# EAGLE design CarPC-CC-Var2 (EAGLE 9.5.2)
Car-PC Command & Control sowie Power Distribution Board für PC, Access-Point

## Sheet 1 of 2
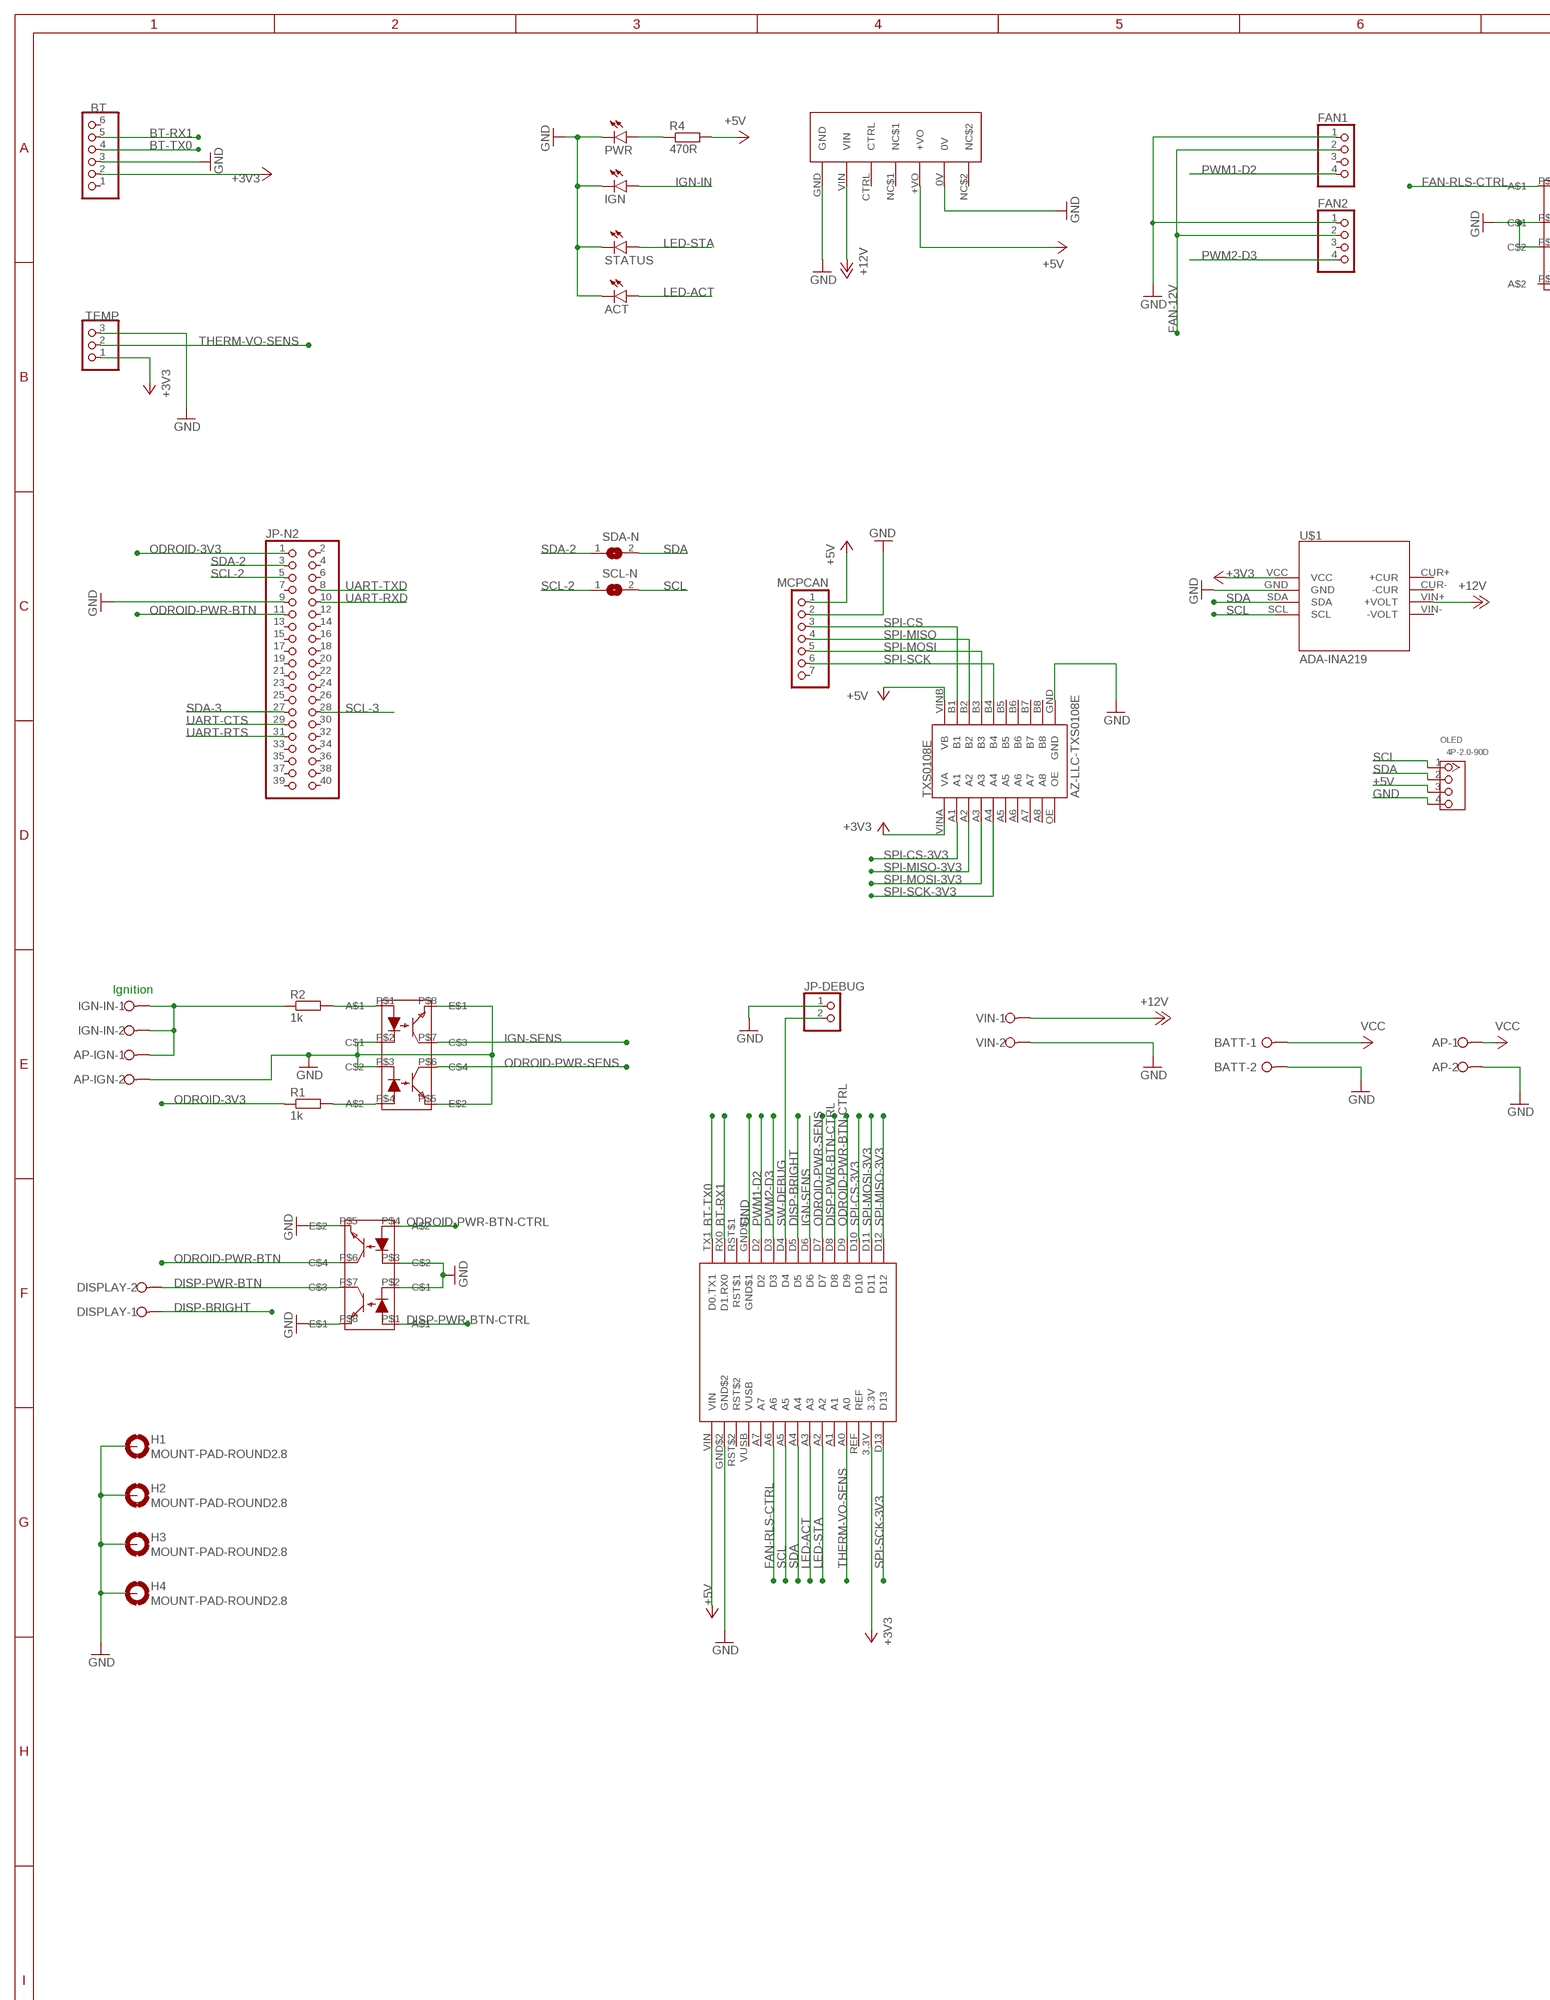
[diagram p0: schematic, sheet 1, part 1 of 2]
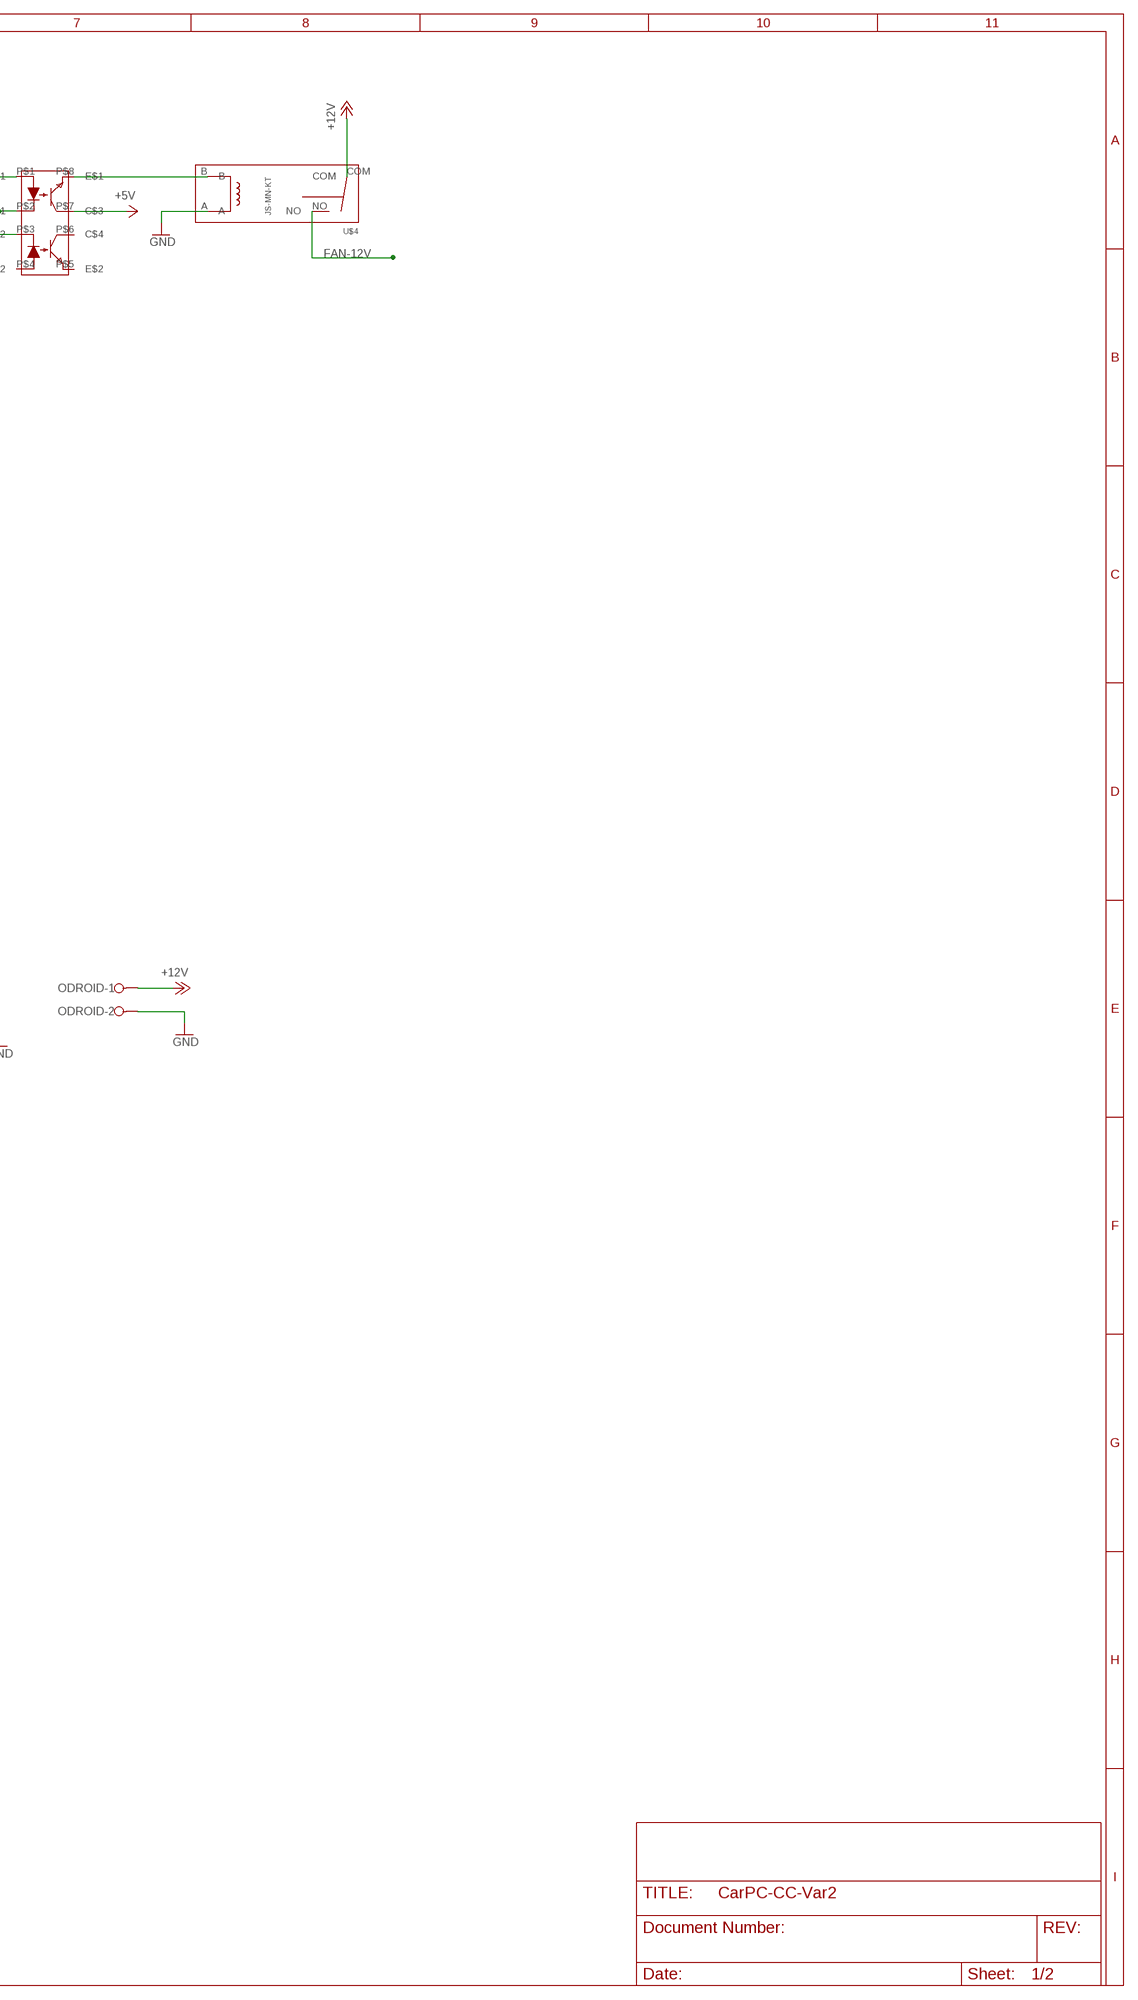
[diagram p1: schematic, sheet 1, part 2 of 2]

### Parts
ACT  LED3MM  [LED3MM]
AP  W237-02P  [W237-132]
AP-IGN  W237-02P  [W237-132]
ARD-NANO-33-IOT  ARDUINONANO33IOT  [FPR_ARDNANO33IOT]
BATT  W237-02P  [W237-132]
BT  PINHD-1X6/90  [1X06/90]
DISPLAY  W237-02P  [W237-132]
FAN1  PINHD-1X4  [1X04]
FAN2  PINHD-1X4  [1X04]
H1  MOUNT-PAD-ROUND2.8  [2,8-PAD]
H2  MOUNT-PAD-ROUND2.8  [2,8-PAD]
H3  MOUNT-PAD-ROUND2.8  [2,8-PAD]
H4  MOUNT-PAD-ROUND2.8  [2,8-PAD]
IGN  LED3MM  [LED3MM]
IGN-IN  W237-02P  [W237-132]
JP-DEBUG  PINHD-1X2  [1X02]
JP-N2  PINHD-2X20  [2X20]
MCPCAN  PINHD-1X7/90  [1X07/90]
ODROID  W237-02P  [W237-132]
OK-FAN-CTRL  ILD74  [FPR_ILD74]
OK-PWR-IGN  ILD74  [FPR_ILD74]
OK-PWR-N2_DISP  ILD74  [FPR_ILD74]
OLED  4P-2.0-90D  GROVE-CONNECTOR-DIP-90D(4P-2.0)  [HW4-2.0-90D]
PWR  LED3MM  [LED3MM]
R1  1k  R-EU_0204/7  [0204/7]
R2  1k  R-EU_0204/7  [0204/7]
R4  470R  R-EU_0204/7  [0204/7]
SCL-N  SJ  [SJ]
SDA-N  SJ  [SJ]
STATUS  LED3MM  [LED3MM]
TEMP  PINHD-1X3/90  [1X03/90]
TXS0108E  AZ-LLC-TXS0108E  [FPR_LLC]
U$1  ADA-INA219  [FPR_INA219]
U$3  6S8W4_2405S1.6RP  [PAC_6S8W4_2405S1.6RP]
U$4  JS-MN-KT  [FPR_JS-MN-KT]
VIN  W237-02P  [W237-132]

### Nets
+3V3 [3V3 Arduino]: ARD-NANO-33-IOT.3.3V BT.2 TEMP.1 TXS0108E.VINA(VA) U$1.VCC
+5V [5v Regulated]: ARD-NANO-33-IOT.VIN MCPCAN.1 OK-FAN-CTRL.P$7(C$3) OLED.3 R4.2 TXS0108E.VINB(VB) U$3.+VO
+12V [12v Regulated]: ODROID.1 U$1.VIN+(+VOLT) U$3.VIN U$4.COM VIN.1
BT-RX1: ARD-NANO-33-IOT.RX0(D1.RX0) BT.5
BT-TX0: ARD-NANO-33-IOT.TX1(D0.TX1) BT.4
DISP-BRIGHT [3V3 Arduino]: ARD-NANO-33-IOT.D5 DISPLAY.1
DISP-PWR-BTN: DISPLAY.2 OK-PWR-N2_DISP.P$7(C$3)
DISP-PWR-BTN-CTRL [3V3 Arduino]: ARD-NANO-33-IOT.D8 OK-PWR-N2_DISP.P$1(A$1)
FAN-12V [12v Regulated]: FAN1.2 FAN2.2 U$4.NO
FAN-RLS-CTRL [3V3 Arduino]: ARD-NANO-33-IOT.A6 OK-FAN-CTRL.P$1(A$1)
FAN-RLS-TRIG [5v Regulated]: OK-FAN-CTRL.P$8(E$1) U$4.B
GND [Chassis]: ACT.K(C) AP-IGN.2 AP.2 ARD-NANO-33-IOT.GND$1 ARD-NANO-33-IOT.GND$2 BATT.2 BT.3 FAN1.1 FAN2.1 H1.B2,8(MOUNT) H2.B2,8(MOUNT) H3.B2,8(MOUNT) H4.B2,8(MOUNT) IGN.K(C) JP-DEBUG.1 JP-N2.9 MCPCAN.2 ODROID.2 OK-FAN-CTRL.P$2(C$1) OK-FAN-CTRL.P$3(C$2) OK-PWR-IGN.P$2(C$1) OK-PWR-IGN.P$3(C$2) OK-PWR-IGN.P$5(E$2) OK-PWR-IGN.P$8(E$1) OK-PWR-N2_DISP.P$2(C$1) OK-PWR-N2_DISP.P$3(C$2) OK-PWR-N2_DISP.P$5(E$2) OK-PWR-N2_DISP.P$8(E$1) OLED.4 PWR.K(C) STATUS.K(C) TEMP.3 TXS0108E.GND U$1.GND U$3.0V U$3.GND U$4.A VIN.2
IGN [11..14v Ignition]: AP-IGN.1 IGN-IN.1 IGN-IN.2 R2.1
IGN-IN: IGN.A OK-PWR-IGN.P$1(A$1) R2.2
IGN-SENS [3V3 Arduino]: ARD-NANO-33-IOT.D6 OK-PWR-IGN.P$7(C$3)
LED-ACT: ACT.A ARD-NANO-33-IOT.A3
LED-PWR$1 [5v Regulated]: PWR.A R4.1
LED-STA: ARD-NANO-33-IOT.A2 STATUS.A
ODROID-3V3: JP-N2.1 R1.1
ODROID-3V3$2: OK-PWR-IGN.P$4(A$2) R1.2
ODROID-PWR-BTN: JP-N2.11 OK-PWR-N2_DISP.P$6(C$4)
ODROID-PWR-BTN-CTRL [3V3 Arduino]: ARD-NANO-33-IOT.D9 OK-PWR-N2_DISP.P$4(A$2)
ODROID-PWR-SENS [3V3 Arduino]: ARD-NANO-33-IOT.D7 OK-PWR-IGN.P$6(C$4)
PWM1-D2 [3V3 Signal]: ARD-NANO-33-IOT.D2 FAN1.4
PWM2-D3 [3V3 Signal]: ARD-NANO-33-IOT.D3 FAN2.4
SCL [3V3 Signal]: ARD-NANO-33-IOT.A5 OLED.1 SCL-N.2 U$1.SCL
SCL-2: JP-N2.5 SCL-N.1
SCL-3: JP-N2.28
SDA [3V3 Signal]: ARD-NANO-33-IOT.A4 OLED.2 SDA-N.2 U$1.SDA
SDA-2: JP-N2.3 SDA-N.1
SDA-3: JP-N2.27
SPI-CS [5V Signal]: MCPCAN.3 TXS0108E.B1
SPI-CS-3V3: ARD-NANO-33-IOT.D10 TXS0108E.A1
SPI-MISO [5V Signal]: MCPCAN.4 TXS0108E.B2
SPI-MISO-3V3: ARD-NANO-33-IOT.D12 TXS0108E.A2
SPI-MOSI [5V Signal]: MCPCAN.5 TXS0108E.B3
SPI-MOSI-3V3 [3V3 Arduino]: ARD-NANO-33-IOT.D11 TXS0108E.A3
SPI-SCK [5V Signal]: MCPCAN.6 TXS0108E.B4
SPI-SCK-3V3 [3V3 Arduino]: ARD-NANO-33-IOT.D13 TXS0108E.A4
SW-DEBUG: ARD-NANO-33-IOT.D4 JP-DEBUG.2
THERM-VO-SENS [3V3 Arduino]: ARD-NANO-33-IOT.A0 TEMP.2
UART-CTS: JP-N2.29
UART-RTS: JP-N2.31
UART-RXD: JP-N2.10
UART-TXD: JP-N2.8
VCC [11..14v Unfused]: AP.1 BATT.1
Unconnected: ARD-NANO-33-IOT.A1 ARD-NANO-33-IOT.A7 ARD-NANO-33-IOT.REF ARD-NANO-33-IOT.RST$1 ARD-NANO-33-IOT.RST$2 ARD-NANO-33-IOT.VUSB BT.1 BT.6 FAN1.3 FAN2.3 JP-N2.2 JP-N2.4 JP-N2.6 JP-N2.7 JP-N2.12 JP-N2.13 JP-N2.14 JP-N2.15 JP-N2.16 JP-N2.17 JP-N2.18 JP-N2.19 JP-N2.20 JP-N2.21 JP-N2.22 JP-N2.23 JP-N2.24 JP-N2.25 JP-N2.26 JP-N2.30 JP-N2.32 JP-N2.33 JP-N2.34 JP-N2.35 JP-N2.36 JP-N2.37 JP-N2.38 JP-N2.39 JP-N2.40 MCPCAN.7 OK-FAN-CTRL.P$4(A$2) OK-FAN-CTRL.P$5(E$2) OK-FAN-CTRL.P$6(C$4) TXS0108E.A5 TXS0108E.A6 TXS0108E.A7 TXS0108E.A8 TXS0108E.B5 TXS0108E.B6 TXS0108E.B7 TXS0108E.B8 TXS0108E.OE U$1.CUR+(+CUR) U$1.CUR-(-CUR) U$1.VIN-(-VOLT) U$3.CTRL U$3.NC$1 U$3.NC$2

### Notes on the sheet
- Ignition

## Sheet 2 of 2

## Library data of the parts
ACT IGN PWR STATUS = led:LED: LED OSRAM: - CHIPLED LG R971, LG N971, LY N971, LG Q971, LY Q971, LO R971, LY R971 LH N974, LH R974 LS Q976, LO Q976, LY Q976 LO Q996 - Hyper CHIPLED LW Q18S LB Q993, LB Q99A, LB R99A - SideLED LS A670, LO A670, LY A670, LG A670, LP A670 LB A673, LV A673, LT A673, LW A673 LH A674 LY A675 LS A676, LA A676, LO A676, LY A676, LW A676 LS A679, LY A679, LG A679 - Hyper Micro SIDELED® LS Y876, LA Y876, LO Y876, LY Y876 LT Y87S - SmartLED LW L88C, LW L88S LB L89C, LB L89S, LG L890 LS L89K, LO L89K, LY L89K LS L896, LA L896, LO L896, LY L896 - TOPLED LS T670, LO T670, LY T670, LG T670, LP T670 LSG T670, LSP T670, LSY T670, LOP T670, LYG T670 LG T671, LOG T671, LSG T671 LB T673, LV T673, LT T673, LW T673 LH T674 LS T676, LA T676, LO T676, LY T676, LB T676, LH T676, LSB T676, LW T676 LB T67C, LV T67C, LT T67C, LS T67K, LO T67K, LY T67K, LW E67C LS E67B, LA E67B, LO E67B, LY E67B, LB E67C, LV E67C, LT E67C LW T67C LS T679, LY T679, LG T679 LS T770, LO T770, LY T770, LG T770, LP T770 LB T773, LV T773, LT T773, LW T773 LH T774 LS E675, LA E675, LY E675, LS T675 LS T776, LA T776, LO T776, LY T776, LB T776 LHGB T686 LT T68C, LB T68C - Hyper Mini TOPLED® LB M676 - Mini TOPLED Santana® LG M470 LS M47K, LO M47K, LY M47K Source: http://www.osram.convergy.de LUXEON: - LUMILED® LXK2-PW12-R00, LXK2-PW12-S00, LXK2-PW14-U00, LXK2-PW14-V00 LXK2-PM12-R00, LXK2-PM12-S00, LXK2-PM14-U00 LXK2-PE12-Q00, LXK2-PE12-R00, LXK2-PE12-S00, LXK2-PE14-T00, LXK2-PE14-U00 LXK2-PB12-K00, LXK2-PB12-L00, LXK2-PB12-M00, LXK2-PB14-N00, LXK2-PB14-P00, LXK2-PB14-Q00 LXK2-PR12-L00, LXK2-PR12-M00, LXK2-PR14-Q00, LXK2-PR14-R00 LXK2-PD12-Q00, LXK2-PD12-R00, LXK2-PD12-S00 LXK2-PH12-R00, LXK2-PH12-S00 LXK2-PL12-P00, LXK2-PL12-Q00, LXK2-PL12-R00 Source: www.luxeon.com KINGBRIGHT: KA-3528ASYC Source: www.kingbright.com
AP AP-IGN BATT DISPLAY IGN-IN ODROID VIN = con-wago-508:W237-02P: WAGO SREW CLAMP; OC_FARNELL: unknown; OC_NEWARK: unknown
ARD-NANO-33-IOT = Custom:ARDUINONANO33IOT
BT = pinhead:PINHD-1X6: PIN HEADER
FAN1 FAN2 = pinhead:PINHD-1X4: PIN HEADER
H1-H4 = holes:MOUNT-PAD-ROUND: MOUNTING PAD, round
JP-DEBUG = pinhead:PINHD-1X2: PIN HEADER
JP-N2 = pinhead:PINHD-2X20: PIN HEADER
MCPCAN = pinhead:PINHD-1X7: PIN HEADER
OK-FAN-CTRL OK-PWR-IGN OK-PWR-N2_DISP = Custom:ILD74
OLED = Custom:GROVE-CONNECTOR-DIP-90D(4P-2.0): 320110034
R1 R2 R4 = rcl:R-EU_: RESISTOR, European symbol; SPICEPREFIX: R
SCL-N SDA-N = jumper:SJ: SMD solder JUMPER
TEMP = pinhead:PINHD-1X3: PIN HEADER
TXS0108E = Custom:AZ-LLC-TXS0108E
U$1 = Custom:ADA-INA219
U$3 = Custom:6S8W4_2405S1.6RP
U$4 = Custom:JS-MN-KT

## Net classes
0 default: width 0.127 mm, clearance 0.127 mm
1 5v Regulated: width 0.762 mm, clearance 0.508 mm
2 12v Regulated: width 0.762 mm, clearance 0.762 mm
3 11..14v Ignition: width 1.27 mm, clearance 1.27 mm
4 11..14v Generator: width 1.27 mm, clearance 1.016 mm
5 Chassis: width 0.762 mm, clearance 0.127 mm
6 0v Isolated: width 0.762 mm, clearance 0.127 mm
7 3V3 Arduino: width 0.127 mm, clearance 0.127 mm
8 5V Signal: width 0.127 mm, clearance 0.127 mm
9 3V3 Signal: width 0.127 mm, clearance 0.127 mm
10 11..14v Unfused: width 2.54 mm, clearance 2.54 mm

## Board
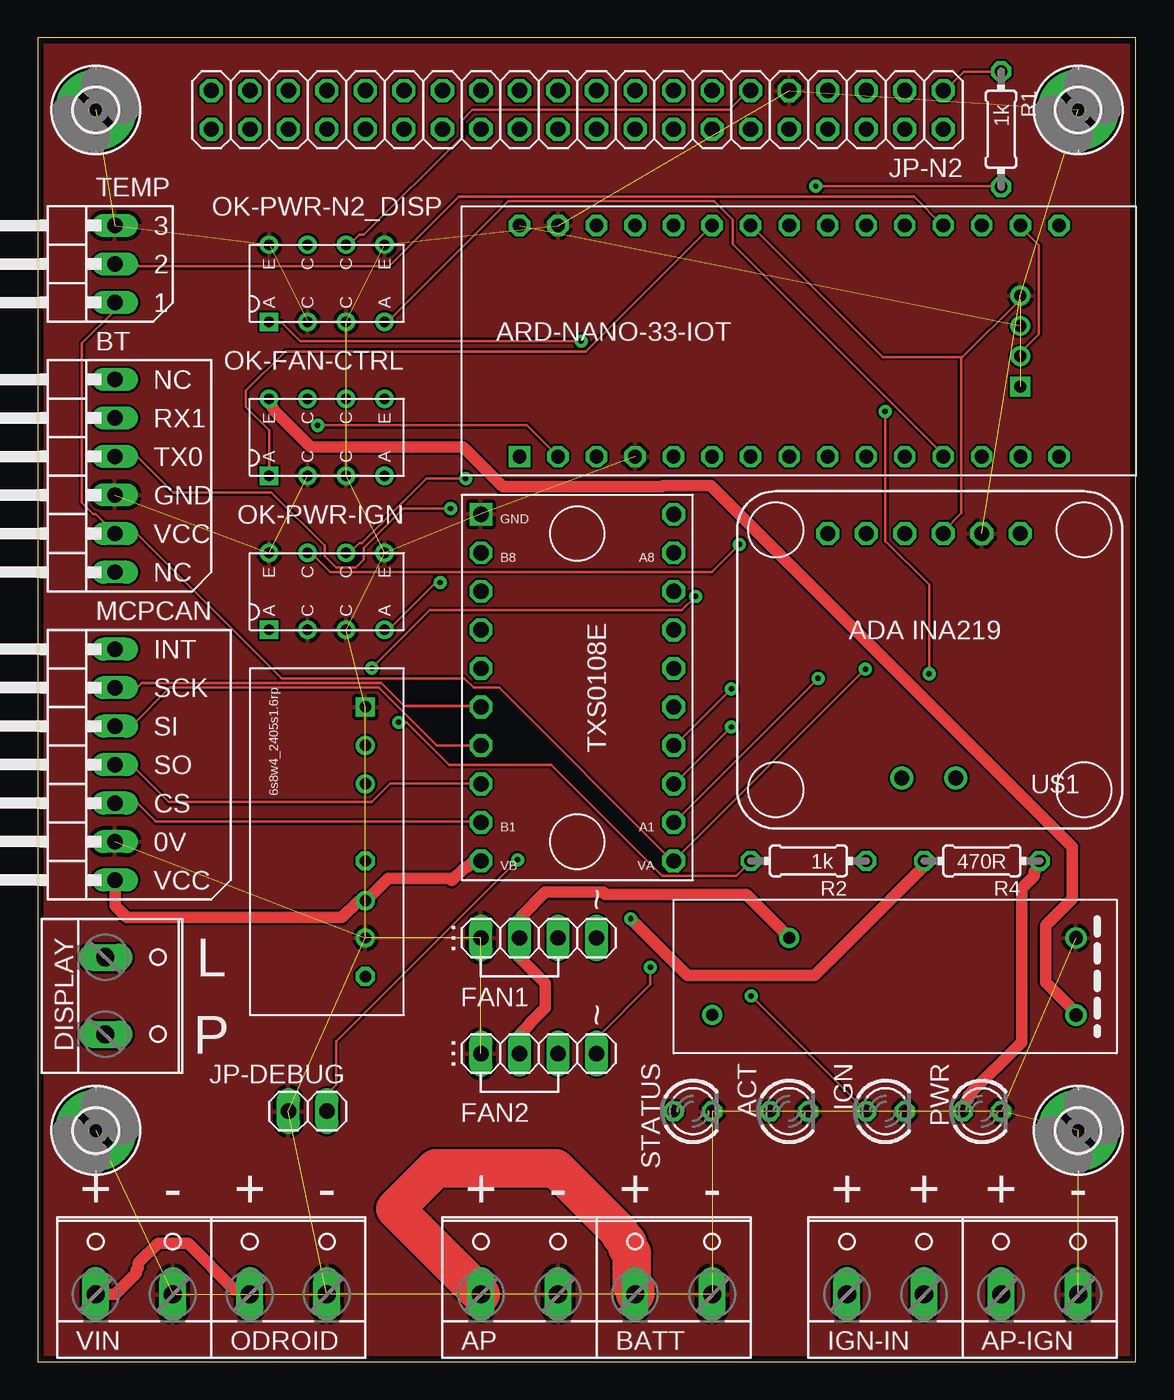
[diagram p2: board, top side]
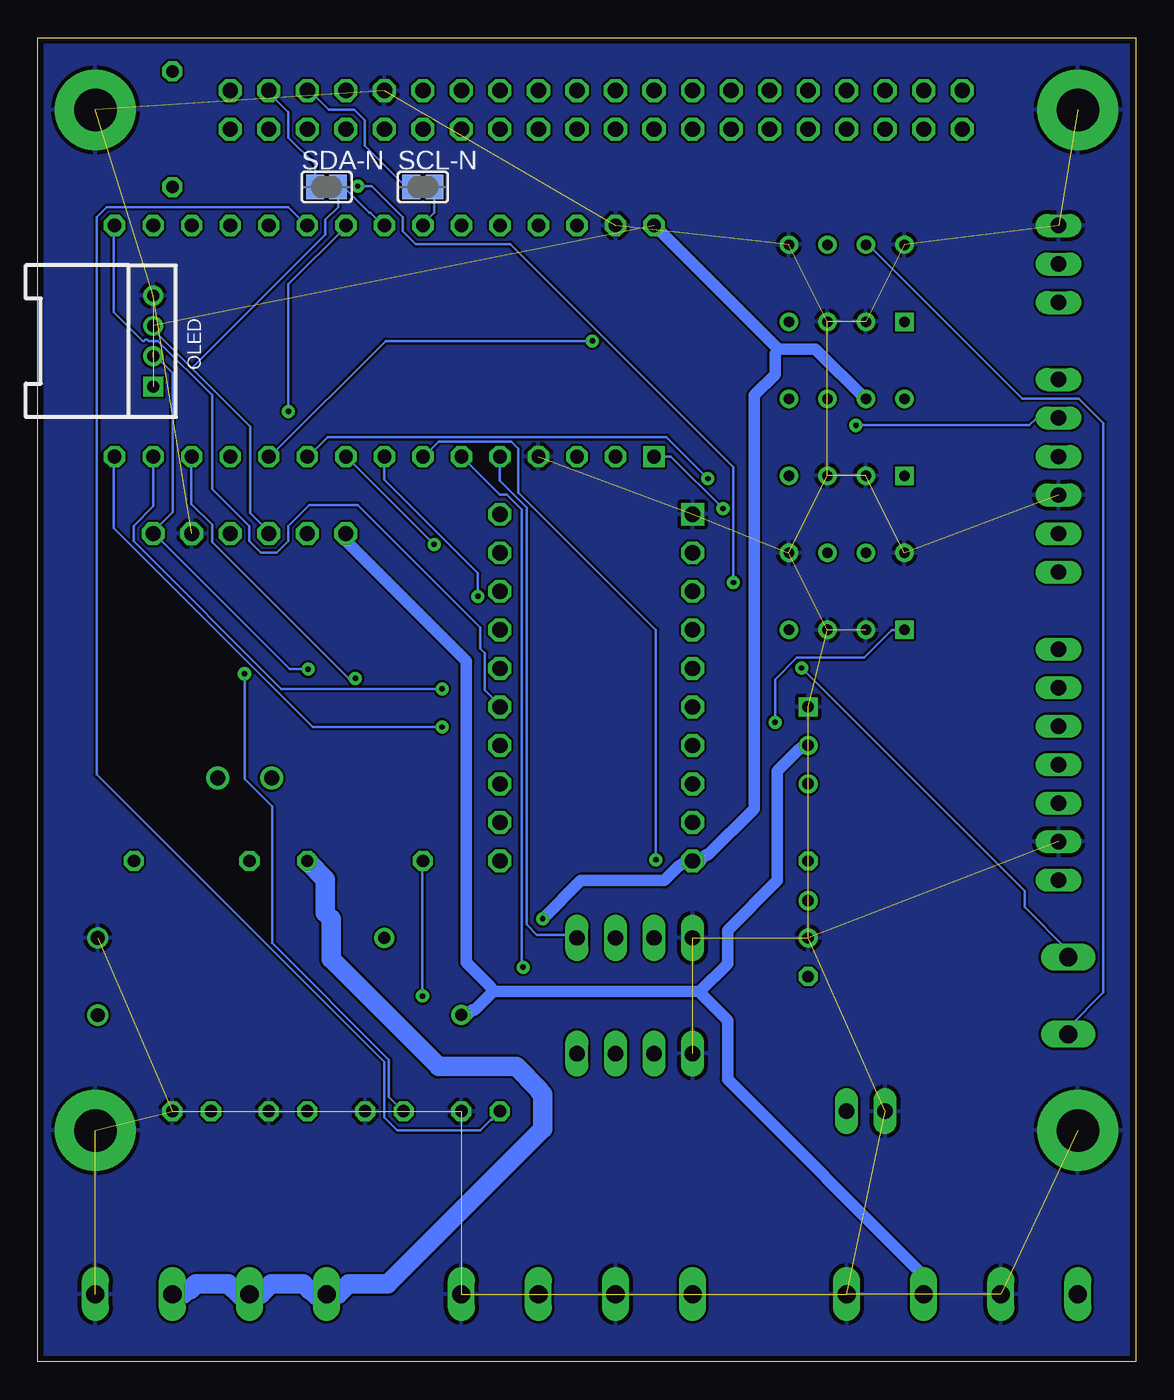
[diagram p3: board, bottom side, seen from below]

Size 72.37 x 87.3 mm. Coordinates in mm from the lower left corner, seen from the top.
Outline: 0,0 72.37,0 72.37,87.3 0,87.3 0,0
Copper layers (1*16): Top 0.035mm / dielectric 1.5mm / Bottom 0.035mm
Design rules "aisler": minimum track width 6mil, minimum drill 0.35mm, track to track 6mil, track to pad 6mil, pad to pad 6mil, via to via 10mil, smd to smd 6mil, copper to edge 15mil, drill to drill 6mil, minimum pad ring 10mil, minimum via ring 10mil, stop-mask expansion 2mil, vias tented up to drill 15mil, thermal gap 10mil

### Footprints (pad centres in the part's own frame; a part is rotated, then mirrored left to right if it is on the bottom)
LED3MM = drill 0.813 octagon: A -1.27,0; K 1.27,0
W237-132 = drill 1.194 long: 1 -2.54,-0.635; 2 2.54,-0.635
FPR_ARDNANO33IOT = drill 0.9 octagon: 3.3V 33.02,15.24; A0 27.94,15.24; A1 25.4,15.24; A2 22.86,15.24; A3 20.32,15.24; A4 17.78,15.24; A5 15.24,15.24; A6 12.7,15.24; A7 10.16,15.24; D2 10.16,0; D3 12.7,0; D4 15.24,0; D5 17.78,0; D6 20.32,0; D7 22.86,0; D8 25.4,0; D9 27.94,0; D10 30.48,0; D11 33.02,0; D12 35.56,0; D13 35.56,15.24; GND$1 7.62,0; GND$2 2.54,15.24; REF 30.48,15.24; RST$1 5.08,0; RST$2 5.08,15.24; RX0 2.54,0; VIN 0,15.24; VUSB 7.62,15.24 | drill 0.9 square: TX1 0,0
1X06/90 = drill 1.016 long: 1 -6.35,-3.81; 2 -3.81,-3.81; 3 -1.27,-3.81; 4 1.27,-3.81; 5 3.81,-3.81; 6 6.35,-3.81
1X04 = drill 1.016 long: 1 -3.81,0; 2 -1.27,0; 3 1.27,0; 4 3.81,0
2,8-PAD = drill 2.8 pad 5.334: B2,8 0,0
1X02 = drill 1.016 long: 1 -1.27,0; 2 1.27,0
2X20 = drill 1.016 octagon: 1 -24.13,-1.27; 2 -24.13,1.27; 3 -21.59,-1.27; 4 -21.59,1.27; 5 -19.05,-1.27; 6 -19.05,1.27; 7 -16.51,-1.27; 8 -16.51,1.27; 9 -13.97,-1.27; 10 -13.97,1.27; 11 -11.43,-1.27; 12 -11.43,1.27; 13 -8.89,-1.27; 14 -8.89,1.27; 15 -6.35,-1.27; 16 -6.35,1.27; 17 -3.81,-1.27; 18 -3.81,1.27; 19 -1.27,-1.27; 20 -1.27,1.27; 21 1.27,-1.27; 22 1.27,1.27; 23 3.81,-1.27; 24 3.81,1.27; 25 6.35,-1.27; 26 6.35,1.27; 27 8.89,-1.27; 28 8.89,1.27; 29 11.43,-1.27; 30 11.43,1.27; 31 13.97,-1.27; 32 13.97,1.27; 33 16.51,-1.27; 34 16.51,1.27; 35 19.05,-1.27; 36 19.05,1.27; 37 21.59,-1.27; 38 21.59,1.27; 39 24.13,-1.27; 40 24.13,1.27
1X07/90 = drill 1.016 long: 1 -7.62,-3.81; 2 -5.08,-3.81; 3 -2.54,-3.81; 4 0,-3.81; 5 2.54,-3.81; 6 5.08,-3.81; 7 7.62,-3.81
FPR_ILD74 = drill 0.7 square: P$1 -2.54,5.08 | drill 0.7: P$2 -2.54,2.54; P$3 -2.54,0; P$4 -2.54,-2.54; P$5 2.54,-2.54; P$6 2.54,0; P$7 2.54,2.54; P$8 2.54,5.08
HW4-2.0-90D = drill 0.8 pad 1.27 square: 1 -3,0 | drill 0.8 pad 1.27: 2 -1,0; 3 1,0; 4 3,0
0204/7 = drill 0.813 octagon: 1 -3.81,0; 2 3.81,0
SJ = smd 1.168 x 1.6: 1 -0.762,0; 2 0.762,0
1X03/90 = drill 1.016 long: 1 -2.54,-3.81; 2 0,-3.81; 3 2.54,-3.81
FPR_LLC = drill 1 octagon: A1 -8.89,-6.35; A2 -6.35,-6.35; A3 -3.81,-6.35; A4 -1.27,-6.35; A5 1.27,-6.35; A6 3.81,-6.35; A7 6.35,-6.35; A8 8.89,-6.35; B1 -8.89,6.35; B2 -6.35,6.35; B3 -3.81,6.35; B4 -1.27,6.35; B5 1.27,6.35; B6 3.81,6.35; B7 6.35,6.35; B8 8.89,6.35; OE 11.43,-6.35; VINA -11.43,-6.35; VINB -11.43,6.35 | drill 1 square: GND 11.43,6.35
FPR_INA219 = drill 1: CUR+ 1.46,12.319; CUR- -2.1,12.319 | drill 1 octagon: GND -3.81,-3.81; SCL -1.27,-3.81; SDA 1.27,-3.81; VCC -6.35,-3.81; VIN+ 6.35,-3.81; VIN- 3.81,-3.81
PAC_6S8W4_2405S1.6RP = drill 0.75: 0V 15.24,0; +VO 12.78,0; CTRL 5.08,0; VIN 2.54,0 | drill 0.75 square: GND 0,0 | drill 0.75 octagon: NC$1 10.16,0; NC$2 17.78,0
FPR_JS-MN-KT = drill 0.9: A 18.9,5.08; B 18.9,0 | drill 0.8: COM -5.08,0; NO 0,5.08

### Placement (x,y rotation side)
ACT  49.53,16.51 0 top
AP  31.75,5.08 0 top
AP-IGN  66.04,5.08 0 top
ARD-NANO-33-IOT  31.75,59.69 0 top
BATT  41.91,5.08 0 top
BT  1.27,58.42 90 top
DISPLAY  5.08,24.13 270 top
FAN1  33.02,27.94 0 top
FAN2  33.02,20.32 0 top
H1  3.81,15.24 0 top
H2  68.58,15.24 0 top
H3  68.58,82.55 0 top
H4  3.81,82.55 0 top
IGN  55.88,16.51 0 top
IGN-IN  55.88,5.08 0 top
JP-DEBUG  17.78,16.51 0 top
JP-N2  35.56,82.55 180 top
MCPCAN  1.27,39.37 90 top
ODROID  16.51,5.08 0 top
OK-FAN-CTRL  20.32,60.96 90 top
OK-PWR-IGN  20.32,50.8 90 top
OK-PWR-N2_DISP  20.32,71.12 90 top
OLED  64.77,67.31 90 bottom
PWR  62.23,16.51 0 top
R1  63.5,81.28 270 top
R2  50.8,33.02 180 top
R4  62.23,33.02 180 top
SCL-N  46.99,77.47 0 bottom
SDA-N  53.34,77.47 0 bottom
STATUS  43.18,16.51 0 top
TEMP  1.27,72.39 90 top
TXS0108E  35.56,44.45 90 top
U$1  58.42,50.8 180 top
U$3  21.59,43.18 270 top
U$4  49.53,22.86 0 top
VIN  6.35,5.08 0 top

### Tracks (layer width: path | path; a pad name or v marks a point on that pad's centre or on a via)
+3V3  (via drill 0.35)  (1 unrouted)
  Top 0.152: TEMP.1 5.03,69.83 5.03,69.29 2.9,67.16 2.9,56.64 3.66,55.88 3.81,55.88 BT.2 5.11,54.58 6.55,54.58 16.08,45.06 28.12,45.06 28.73,44.45 30.4,44.45 41.76,33.1 41.91,33.1 TXS0108E.VINA v54.56,45.67 | 64.77,66.55 65.99,67.77 65.99,73.63 64.77,74.85 ARD-NANO-33-IOT.3.3V
  Bottom 0.152: v54.56,45.67 55.78,45.67 64.77,54.66 U$1.VCC 64.69,54.66 64.69,54.81 63.48,56.03 63.48,65.18 64.54,66.24 64.77,66.24
+5V  (via drill 0.35)  (1 unrouted)
  Top 0.762: TXS0108E.VINB 29.18,33.02 29.11,33.1 28.8,33.1 28.35,32.64 28.19,32.64 27.28,31.72 27.13,31.88 23.09,31.88 21.64,30.43 U$3.+VO 21.18,30.35 21.11,30.35 20.04,29.29 5.87,29.29 5.11,30.05 5.11,31.72 MCPCAN.1 | v39.09,29.21 42.82,25.48 51.21,25.48 58.37,32.64 58.37,33.02 R4.2
  Bottom 0.762: 23.55,66.78 21.11,66.78 17.83,63.5 OK-FAN-CTRL.P$7 | 23.55,66.78 31.7,74.93 ARD-NANO-33-IOT.VIN | v39.09,29.21 36.58,31.72 31.09,31.72 30.1,32.72 30.02,32.72 29.64,33.1 29.34,33.1 29.26,33.02 TXS0108E.VINB 28.88,32.87 28.35,33.4 28.19,33.4 25.15,36.45 25.15,63.73 23.77,65.1 23.77,66.47 23.55,66.78
+12V
  Top 0.762: VIN.1 5.11,4.45 6.48,5.82 6.48,6.05 6.63,6.2 6.63,6.5 7.92,7.8 9.91,7.8 12.95,4.75 13.64,4.75 13.95,4.45 ODROID.1
  Bottom 0.762: U$3.VIN 21.87,40.64 22.1,40.41 22.17,40.41 23.62,38.96 23.62,31.72 26.9,28.45 26.9,26.24 28.73,24.41 | 42.37,24.41 28.73,24.41 | 42.37,24.41 43.59,23.19 43.74,23.19 44.12,22.81 44.42,22.81 U$4.COM | U$1.VIN+ 52.05,54.58 52.05,54.13 44.12,46.2 44.12,26.31 42.52,24.71 42.37,24.41 | ODROID.1 14.02,4.45 14.02,5.74 26.9,18.62 26.9,22.5 28.5,24.11 28.73,24.41
BT-RX1  (via drill 0.35)
  Top 0.152: ARD-NANO-33-IOT.RX0 32.23,61.75 v18.44,61.75
  Bottom 0.152: v18.44,61.75 7.01,61.75 6.55,62.2 5.11,62.2 BT.5
BT-TX0  (via drill 0.35)
  Top 0.152: v27.2,56.26 24.08,56.26 21.49,53.67 21.49,52.91 20.95,52.38 19.66,52.38 18.9,53.14 18.9,53.82 15.39,57.33 8.91,57.33 6.55,59.69 BT.4
  Bottom 0.152: ARD-NANO-33-IOT.TX1 30.63,59.69 v27.2,56.26
DISP-BRIGHT  (via drill 0.35)
  Top 0.152: v43.36,50.47 42.44,49.56 25.83,49.56 v22.02,45.75
  Bottom 0.152: ARD-NANO-33-IOT.D5 49.53,58.17 43.36,51.99 v43.36,50.47 | v22.02,45.75 7.32,31.04 7.32,29.97 4.5,27.15 4.5,26.7 DISPLAY.1
DISP-PWR-BTN
  Bottom 0.152: OK-PWR-N2_DISP.P$7 17.75,73.63 17.6,73.63 7.47,63.5 3.73,63.5 2.13,61.9 2.13,24.33 4.42,22.05 4.42,21.59 DISPLAY.2
DISP-PWR-BTN-CTRL  (via drill 0.35)
  Top 0.152: v35.81,67.31 17.3,67.31 16.08,68.53 15.24,68.53 OK-PWR-N2_DISP.P$1
  Bottom 0.152: v35.81,67.31 49.45,67.31 57.07,59.69 ARD-NANO-33-IOT.D8
FAN-12V
  Top 0.762: U$4.NO 49.53,27.99 46.71,30.81 37.41,30.81 37.26,30.96 33.45,30.96 31.85,29.36 31.85,29.29 31.7,29.13 31.7,27.99 FAN1.2 31.62,27.61 31.62,26.77 33.45,24.94 33.45,23.34 32.38,22.28 32.38,22.2 31.77,21.59 31.77,20.37 FAN2.2
FAN-RLS-CTRL
  Top 0.152: OK-FAN-CTRL.P$1 15.24,61.44 13.72,62.97 13.72,64.03 16.31,66.62 36.12,66.62 44.42,74.93 ARD-NANO-33-IOT.A6
FAN-RLS-TRIG
  Top 0.762: OK-FAN-CTRL.P$8 15.24,63.19 15.47,62.97 15.47,62.89 15.54,62.81 15.54,62.74 17.98,60.3 28.04,60.3 30.63,57.71 41.15,57.71 41.22,57.78 44.35,57.78 68.2,33.93 68.2,30.5 66.45,28.75 66.45,25.02 68.43,23.04 68.43,22.89 U$4.B
GND  (37 unrouted)
  pour Bottom: 0,88.9 73.66,88.9 73.66,-1.27 -1.27,-1.27 -1.27,88.9
  pour Top: -1.27,91.44 73.66,91.44 73.66,-1.27 -1.27,-1.27
IGN
  Bottom 1.27: R2.1 54.56,33.02 54.56,32.94 53.42,31.8 53.42,29.59 53.03,29.21 53.03,26.54 45.95,19.46 40.84,19.46 39.32,17.93 39.32,17.86 39.09,17.63 39.09,15.34 49.3,5.13 51.89,5.13 52.58,4.45 IGN-IN.1 53.95,4.29 54.41,4.75 54.48,4.75 54.86,5.13 57,5.13 57.68,4.45 IGN-IN.2 58.98,4.29 59.82,5.13 61.95,5.13 62.33,4.75 62.48,4.75 62.79,4.45 AP-IGN.1
IGN-IN  (via drill 0.35)
  Top 0.152: v23.77,42.16 24.31,42.16 27.13,39.34 33.83,39.34 41.15,32.03 46.02,32.03 47.02,33.02 R2.2 | v47.02,24.11 IGN.A
  Bottom 0.152: OK-PWR-IGN.P$1 16.08,48.26 17.91,46.43 22.33,46.43 23.77,44.98 v23.77,42.16 | v47.02,24.11 47.02,33.02 R2.2
IGN-SENS  (via drill 0.35)
  Top 0.152: v46.25,53.9 44.42,52.07 19.28,52.07 18.06,53.29 17.83,53.29 OK-PWR-IGN.P$7
  Bottom 0.152: v46.25,53.9 52.05,59.69 ARD-NANO-33-IOT.D6
LED-ACT  (via drill 0.35)
  Top 0.152: v58.75,45.36 58.75,51.23 55.85,54.13 v55.85,62.66
  Bottom 0.152: ACT.A 49.23,17.48 49.23,19.91 56.92,27.61 56.92,36.6 58.75,38.43 v58.75,45.36 | v55.85,62.66 55.85,71.04 52.12,74.78 52.12,74.93 ARD-NANO-33-IOT.A3
LED-PWR$1
  Top 0.762: PWR.A 60.96,16.87 61.34,17.25 61.34,17.55 64.85,21.06 64.85,31.19 65.68,32.03 65.68,32.33 66.06,32.72 66.06,33.02 R4.1
LED-STA
  Bottom 0.152: STATUS.A 41.91,16.48 42.44,15.95 42.52,15.95 43.2,15.27 48.69,15.27 49.53,16.1 49.53,19.76 68.5,38.73 68.5,75.46 67.82,76.15 55.85,76.15 54.63,74.93 ARD-NANO-33-IOT.A2
ODROID-3V3
  Top 0.152: R1.1 63.48,85.06 61.04,85.06 59.74,83.77 JP-N2.1
ODROID-3V3$2  (via drill 0.35)
  Top 0.152: OK-PWR-IGN.P$4 23.09,48.26 26.21,51.38 v26.52,51.38 | v51.28,77.52 63.48,77.52 R1.2
  Bottom 0.152: v26.52,51.38 26.52,59 41.22,73.71 47.47,73.71 48.31,74.55 48.31,75.46 50.37,77.52 v51.28,77.52
ODROID-PWR-BTN
  Top 0.152: OK-PWR-N2_DISP.P$6 20.34,73.71 20.57,73.71 21.18,74.32 21.49,74.32 27.96,80.8 27.96,81.86 28.65,82.55 45.57,82.55 46.79,83.77 46.94,83.77 JP-N2.11
ODROID-PWR-BTN-CTRL
  Top 0.152: OK-PWR-N2_DISP.P$4 22.86,68.61 23.09,68.61 31.01,76.53 44.58,76.53 45.8,75.31 45.8,73.71 59.66,59.84 59.66,59.69 ARD-NANO-33-IOT.D9
ODROID-PWR-SENS  (via drill 0.35)
  Top 0.152: v28.19,58.24 25.6,58.24 21.34,53.97 21.18,53.97 20.57,53.36 20.34,53.36 OK-PWR-IGN.P$6
  Bottom 0.152: v28.19,58.24 30.94,60.98 53.26,60.98 54.56,59.69 ARD-NANO-33-IOT.D7
PWM1-D2
  Bottom 0.152: ARD-NANO-33-IOT.D2 41.91,58.09 40.16,56.34 40.16,28.83 39.47,28.14 37.03,28.14 FAN1.4
PWM2-D3  (via drill 0.35)
  Top 0.152: v40.39,26.01 40.39,24.87 36.88,21.36 36.88,20.37 FAN2.4
  Bottom 0.152: v40.39,26.01 40.46,26.09 40.46,56.19 41.45,57.17 41.91,57.17 44.42,59.69 ARD-NANO-33-IOT.D3
SCL  (1 unrouted)
  Top 0.152: 60.92,66.2 60.88,66.17 60.88,55.96 59.74,54.81 59.74,54.66 U$1.SCL | 60.92,66.2 64.77,70.05 | ARD-NANO-33-IOT.A5 47.02,74.93 55.7,66.24 60.88,66.24 60.92,66.2
  Bottom 0.152: SCL-N.2 46.25,77.44 46.25,75.77 46.94,75.08 46.94,74.93 ARD-NANO-33-IOT.A5
SCL-2
  Bottom 0.152: SCL-N.1 47.78,77.52 48.16,77.52 50.83,80.19 50.83,81.86 51.51,82.55 53.19,82.55 54.41,83.77 54.56,83.77 JP-N2.5
SDA  (1 unrouted)
  Bottom 0.152: 52.58,77.44 52.2,77.44 50.52,75.77 50.44,75.77 49.61,74.93 ARD-NANO-33-IOT.A4 | 62.22,65.52 58.37,61.67 58.37,55.96 57.15,54.74 U$1.SDA | 62.22,65.52 64.77,68.07 | 52.58,77.44 52.58,76.15 53.42,75.31 53.42,74.32 62.22,65.52 | 52.58,77.44 SDA-N.2
SDA-2
  Bottom 0.152: SDA-N.1 54.1,78.97 55.85,80.72 55.85,82.4 57.15,83.69 JP-N2.3
SPI-CS
  Top 0.152: MCPCAN.3 6.55,36.83 7.77,35.61 29.18,35.61 TXS0108E.B1
SPI-CS-3V3  (via drill 0.35)
  Top 0.152: v51.44,45.06 41.91,35.53 TXS0108E.A1
  Bottom 0.152: v51.44,45.06 51.89,45.06 60.88,54.05 60.88,55.19 62.26,56.57 62.26,59.69 ARD-NANO-33-IOT.D10
SPI-MISO
  Top 0.152: TXS0108E.B2 29.18,38.12 23.24,38.12 22.02,36.91 8.61,36.91 6.17,39.34 5.11,39.34 MCPCAN.4
SPI-MISO-3V3  (via drill 0.35)
  Top 0.152: v45.72,41.86 41.91,38.05 TXS0108E.A2
  Bottom 0.152: v45.72,41.86 54.25,41.86 67.36,54.97 67.36,59.69 ARD-NANO-33-IOT.D12
SPI-MOSI
  Top 0.152: TXS0108E.B3 26.29,40.64 22.48,44.45 8.69,44.45 6.17,41.94 5.11,41.94 MCPCAN.5
SPI-MOSI-3V3  (via drill 0.35)
  Top 0.152: v45.72,44.37 41.99,40.64 TXS0108E.A3
  Bottom 0.152: ARD-NANO-33-IOT.D11 64.77,56.41 66.06,55.12 66.06,54.13 56.31,44.37 v45.72,44.37
SPI-SCK
  Top 0.152: MCPCAN.6 6.55,44.45 6.86,44.75 22.63,44.75 24.16,43.23 29.18,43.23 TXS0108E.B4
SPI-SCK-3V3
  Bottom 0.152: TXS0108E.A4 41.91,43.31 42.9,44.3 42.9,46.74 43.2,47.04 43.2,48.41 51.28,56.49 54.48,56.49 55.85,55.12 55.85,54.13 56.62,53.36 57.68,53.36 58.45,54.13 58.45,55.12 60.88,57.56 60.88,63.73 64.47,67.31 65.08,67.31 65.15,67.39 65.3,67.39 65.38,67.31 65.46,67.31 67.36,69.22 67.36,74.93 ARD-NANO-33-IOT.D13
SW-DEBUG  (via drill 0.35)
  Top 0.152: v31.62,33.1 19.66,21.13 19.66,18.24 19.05,17.63 JP-DEBUG.2
  Bottom 0.152: v31.62,33.1 31.62,48.26 40.69,57.33 40.69,60.22 41.15,60.68 45.95,60.68 46.94,59.69 ARD-NANO-33-IOT.D4
THERM-VO-SENS
  Top 0.152: ARD-NANO-33-IOT.A0 59.66,74.93 57.76,76.83 27.74,76.83 23.16,72.26 6.63,72.26 6.55,72.34 5.11,72.34 TEMP.2
VCC
  Top 2.54: AP.1 29.18,4.45 23.55,10.08 26.21,12.75 34.14,12.75 38.41,8.48 38.41,8.33 38.86,7.87 38.86,7.49 39.17,7.19 39.17,5.05 39.4,4.83 39.4,4.45 BATT.1

### Text on the board
tPlace: 3 | 2 | 1 | NC | RX1 | TX0 | GND | VCC | NC | INT | SCK | SI | SO | CS | 0V | VCC | ~ | ... | L | ~ | P | ... | + | - | + | - | + | - | + | - | + | + | + | -